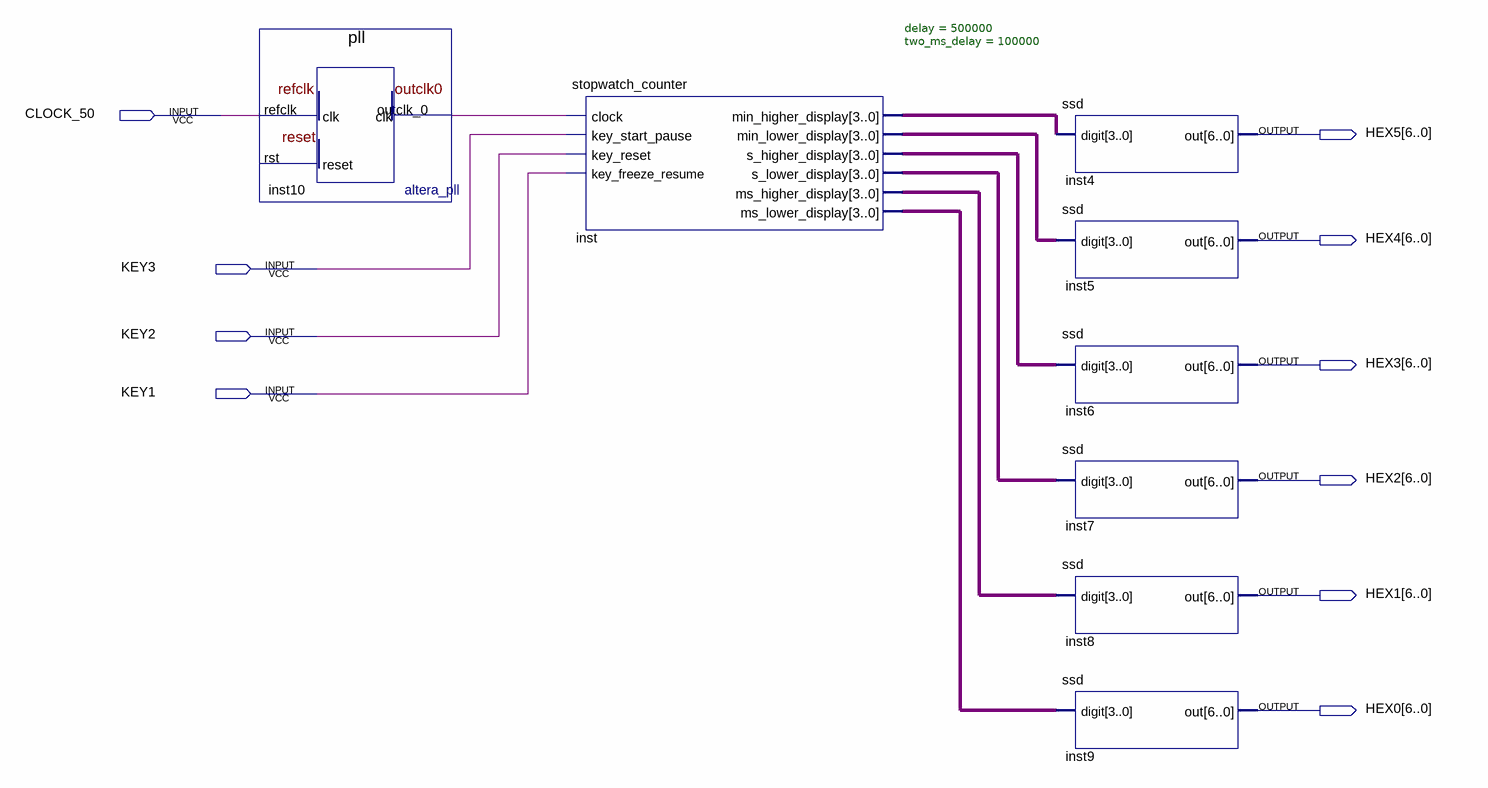
[diagram p0: schematic sheet]
// Quartus schematic stopwatch.bdf as structural Verilog: 8 symbols, 10 pins
module stopwatch (
  input  CLOCK_50,
  input  KEY3,
  input  KEY2,
  input  KEY1,
  output [6:0] HEX5,
  output [6:0] HEX4,
  output [6:0] HEX3,
  output [6:0] HEX2,
  output [6:0] HEX1,
  output [6:0] HEX0
);

  wire inst10_outclk_0;
  wire [3:0] inst_min_higher_display, inst_min_lower_display, inst_ms_higher_display, inst_ms_lower_display,
       inst_s_higher_display, inst_s_lower_display;

  pll inst10 (.refclk(CLOCK_50), .outclk_0(inst10_outclk_0));  // open: rst
  stopwatch_counter #(.delay(500000), .two_ms_delay(100000)) inst (
    .clock(inst10_outclk_0), .key_start_pause(KEY3), .key_reset(KEY2), .key_freeze_resume(KEY1),
    .min_higher_display(inst_min_higher_display), .min_lower_display(inst_min_lower_display),
    .s_higher_display(inst_s_higher_display), .s_lower_display(inst_s_lower_display),
    .ms_higher_display(inst_ms_higher_display), .ms_lower_display(inst_ms_lower_display));
  ssd inst4 (.digit(inst_min_higher_display), .out(HEX5));
  ssd inst5 (.digit(inst_min_lower_display), .out(HEX4));
  ssd inst6 (.digit(inst_s_higher_display), .out(HEX3));
  ssd inst7 (.digit(inst_s_lower_display), .out(HEX2));
  ssd inst8 (.digit(inst_ms_higher_display), .out(HEX1));
  ssd inst9 (.digit(inst_ms_lower_display), .out(HEX0));
endmodule
